# EAGLE design HbSizeSCircuit (EAGLE 8.6.3)

## Sheet 1 of 7: Power Supply
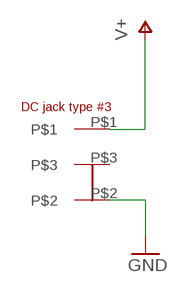
[diagram p0: schematic, sheet 1]

### Parts
U$7  HEC3110-01-010  [HEC3110-01-010]

### Nets
GND: U$7.P$2 ; also sheet 2,3,4,5,6,7
V+: U$7.P$1 ; also sheet 3
Unconnected: U$7.P$3

## Sheet 2 of 7: Power Switch
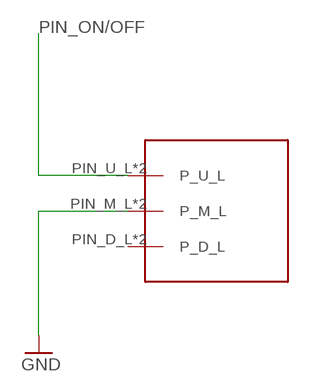
[diagram p1: schematic, sheet 2]

### Parts
U$2  IS-1250_POWERSWITCH  [IS-1250_POWERSWITCH]

### Nets
GND: U$2.PIN_M_L(P_M_L) U$2.PIN_M_R(P_M_L) ; also sheet 1,3,4,5,6,7
PIN_ON/OFF: U$2.PIN_U_L(P_U_L) U$2.PIN_U_R(P_U_L) ; also sheet 3
Unconnected: U$2.PIN_D_L(P_D_L) U$2.PIN_D_R(P_D_L)

## Sheet 3 of 7: DC-DC Converter
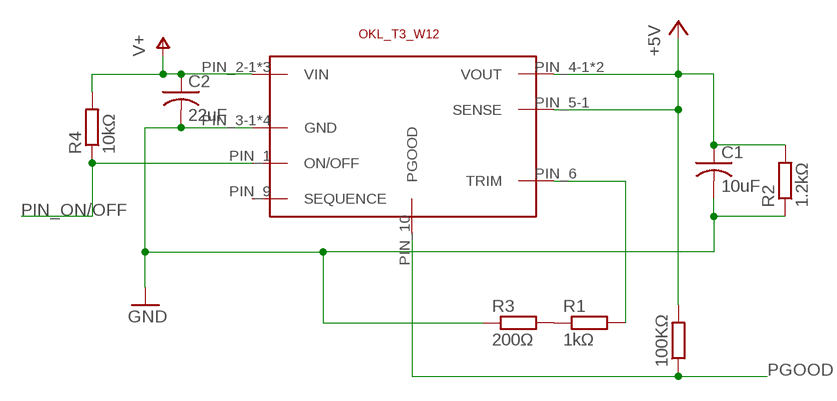
[diagram p2: schematic, sheet 3]

### Parts
100KΩ  R-EU_M1206  [M1206]
C1  10uF  C-USC1206  [C1206]
C2  22uF  C-USC1206  [C1206]
R1  1kΩ  R-EU_M1206  [M1206]
R2  1.2kΩ  R-EU_M1206  [M1206]
R3  200Ω  R-EU_M1206  [M1206]
R4  10kΩ  R-EU_R1206  [R1206]
U$8  OKL_T3_W12  [OKL_T3_W12]

### Nets
+5V: 100KΩ.2 C1.1 R2.2 U$8.PIN_4-1(VOUT) U$8.PIN_4-2(VOUT) U$8.PIN_5-1(SENSE) ; also sheet 5,6,7
GND: C1.2 C2.2 R2.1 R3.1 U$8.PIN_3-1(GND) U$8.PIN_3-2(GND) U$8.PIN_3-3(GND) U$8.PIN_7(GND) ; also sheet 1,2,4,5,6,7
N$1: R1.2 U$8.PIN_6(TRIM)
N$2: R1.1 R3.2
PGOOD: 100KΩ.1 U$8.PIN_10(PGOOD) ; also sheet 6
PIN_ON/OFF: R4.1 U$8.PIN_1(ON/OFF) ; also sheet 2
V+: C2.1 R4.2 U$8.PIN_2-1(VIN) U$8.PIN_2-2(VIN) U$8.PIN_2-3(VIN) ; also sheet 1
Unconnected: U$8.PIN_9(SEQUENCE)

## Sheet 4 of 7: Buttons
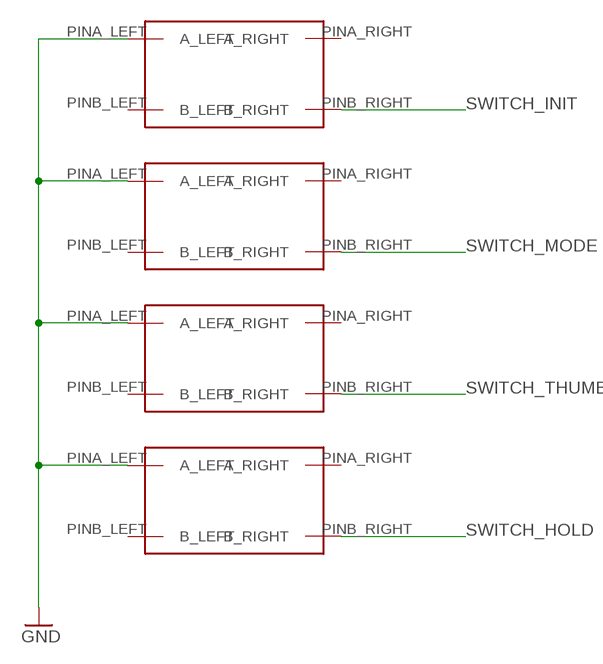
[diagram p3: schematic, sheet 4]

### Parts
U$1  SKRPACE010  [SKRPACE010]
U$3  SKRPACE010  [SKRPACE010]
U$4  SKRPACE010  [SKRPACE010]
U$5  SKRPACE010  [SKRPACE010]

### Nets
GND: U$1.PINA_LEFT(A_LEFT) U$3.PINA_LEFT(A_LEFT) U$4.PINA_LEFT(A_LEFT) U$5.PINA_LEFT(A_LEFT) ; also sheet 1,2,3,5,6,7
SWITCH_HOLD: U$5.PINB_RIGHT(B_RIGHT) ; also sheet 6
SWITCH_INIT: U$1.PINB_RIGHT(B_RIGHT) ; also sheet 6
SWITCH_MODE: U$3.PINB_RIGHT(B_RIGHT) ; also sheet 6
SWITCH_THUMB: U$4.PINB_RIGHT(B_RIGHT) ; also sheet 6
Unconnected: U$1.PINA_RIGHT(A_RIGHT) U$1.PINB_LEFT(B_LEFT) U$3.PINA_RIGHT(A_RIGHT) U$3.PINB_LEFT(B_LEFT) U$4.PINA_RIGHT(A_RIGHT) U$4.PINB_LEFT(B_LEFT) U$5.PINA_RIGHT(A_RIGHT) U$5.PINB_LEFT(B_LEFT)

## Sheet 5 of 7: ServoMotor
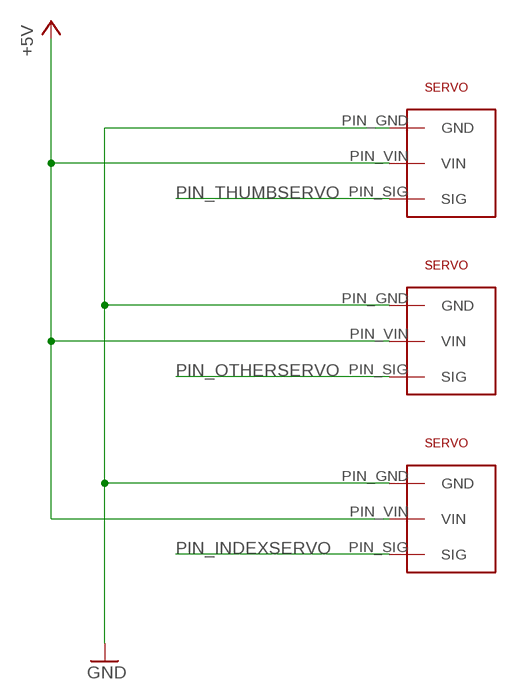
[diagram p4: schematic, sheet 5]

### Parts
U$9  53398-0371  [53398-0371]
U$11  53398-0371  [53398-0371]
U$12  53398-0371  [53398-0371]

### Nets
+5V: U$9.PIN_VIN(VIN) U$11.PIN_VIN(VIN) U$12.PIN_VIN(VIN) ; also sheet 3,6,7
GND: U$9.PIN_GND(GND) U$11.PIN_GND(GND) U$12.PIN_GND(GND) ; also sheet 1,2,3,4,6,7
PIN_INDEXSERVO: U$12.PIN_SIG(SIG) ; also sheet 6
PIN_OTHERSERVO: U$11.PIN_SIG(SIG) ; also sheet 6
PIN_THUMBSERVO: U$9.PIN_SIG(SIG) ; also sheet 6

## Sheet 6 of 7: CPU
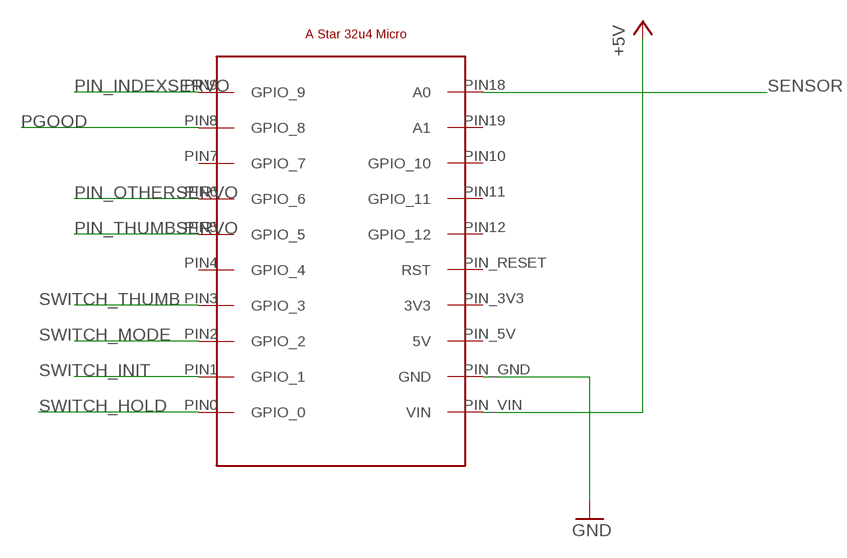
[diagram p5: schematic, sheet 6]

### Parts
U$6  POLOLU_A_STAR_32U4_MICRO_SMD  [POLOLU_A_STAR_32U4_MICRO_SMD]

### Nets
+5V: U$6.PIN_VIN(VIN) ; also sheet 3,5,7
GND: U$6.PIN_GND(GND) ; also sheet 1,2,3,4,5,7
PGOOD: U$6.PIN8(GPIO_8) ; also sheet 3
PIN_INDEXSERVO: U$6.PIN9(GPIO_9) ; also sheet 5
PIN_OTHERSERVO: U$6.PIN6(GPIO_6) ; also sheet 5
PIN_THUMBSERVO: U$6.PIN5(GPIO_5) ; also sheet 5
SENSOR: U$6.PIN18(A0) ; also sheet 7
SWITCH_HOLD: U$6.PIN0(GPIO_0) ; also sheet 4
SWITCH_INIT: U$6.PIN1(GPIO_1) ; also sheet 4
SWITCH_MODE: U$6.PIN2(GPIO_2) ; also sheet 4
SWITCH_THUMB: U$6.PIN3(GPIO_3) ; also sheet 4
Unconnected: U$6.PIN4(GPIO_4) U$6.PIN7(GPIO_7) U$6.PIN10(GPIO_10) U$6.PIN11(GPIO_11) U$6.PIN12(GPIO_12) U$6.PIN19(A1) U$6.PIN_3V3(3V3) U$6.PIN_5V(5V) U$6.PIN_RESET(RST)

## Sheet 7 of 7: Sensor
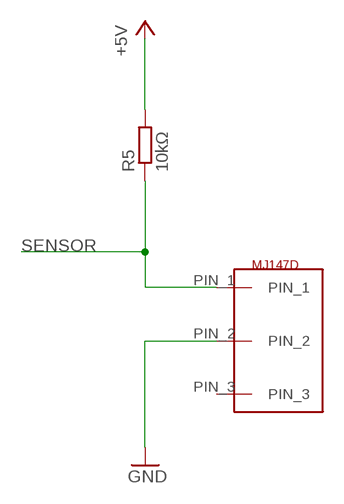
[diagram p6: schematic, sheet 7]

### Parts
R5  10kΩ  R-EU_R1206  [R1206]
U$10  MJ147D  [MJ147D]

### Nets
+5V: R5.2 ; also sheet 3,5,6
GND: U$10.PIN_2 ; also sheet 1,2,3,4,5,6
SENSOR: R5.1 U$10.PIN_1 ; also sheet 6
Unconnected: U$10.PIN_3

## Library data of the parts
100KΩ R1-R5 = resistor:R-EU_: RESISTOR, European symbol
C1 C2 = resistor:C-US: CAPACITOR, American symbol
U$1 U$3-U$5 = HbHandBoard_SizeM:SKRPACE010
U$2 = HbHandBoard_SizeS:IS-1250_POWERSWITCH
U$6 = HbHandBoard_SizeS:POLOLU_A_STAR_32U4_MICRO_SMD
U$7 = HbHandBoard_SizeS:HEC3110-01-010
U$8 = HbHandBoard_SizeS:OKL_T3_W12
U$9 U$11 U$12 = HbHandBoard_SizeS:53398-0371
U$10 = HbHandBoard_SizeS:MJ147D

## Board
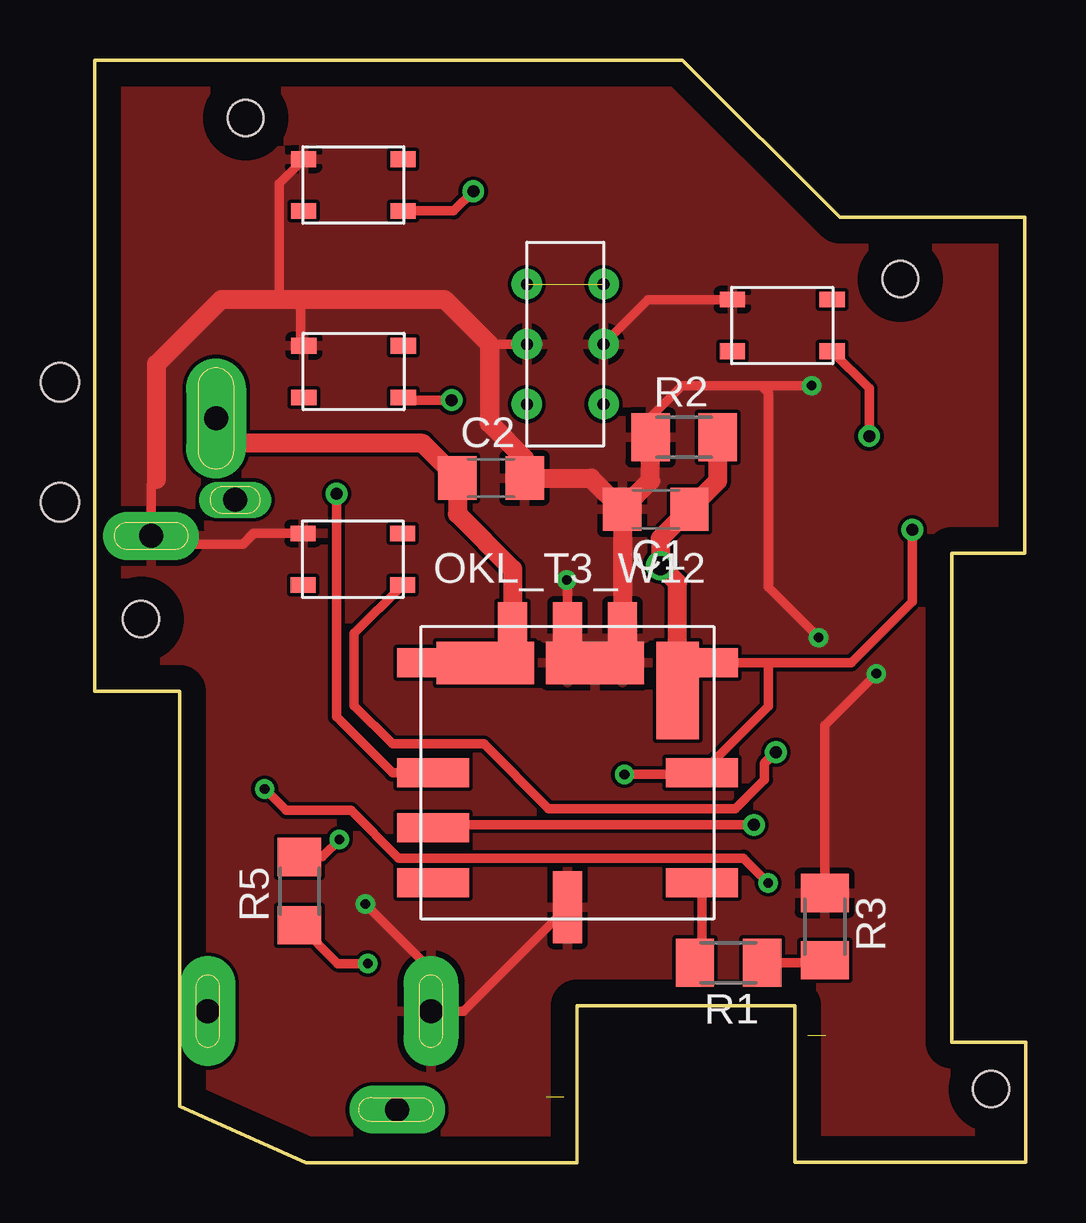
[diagram p7: board, top side]
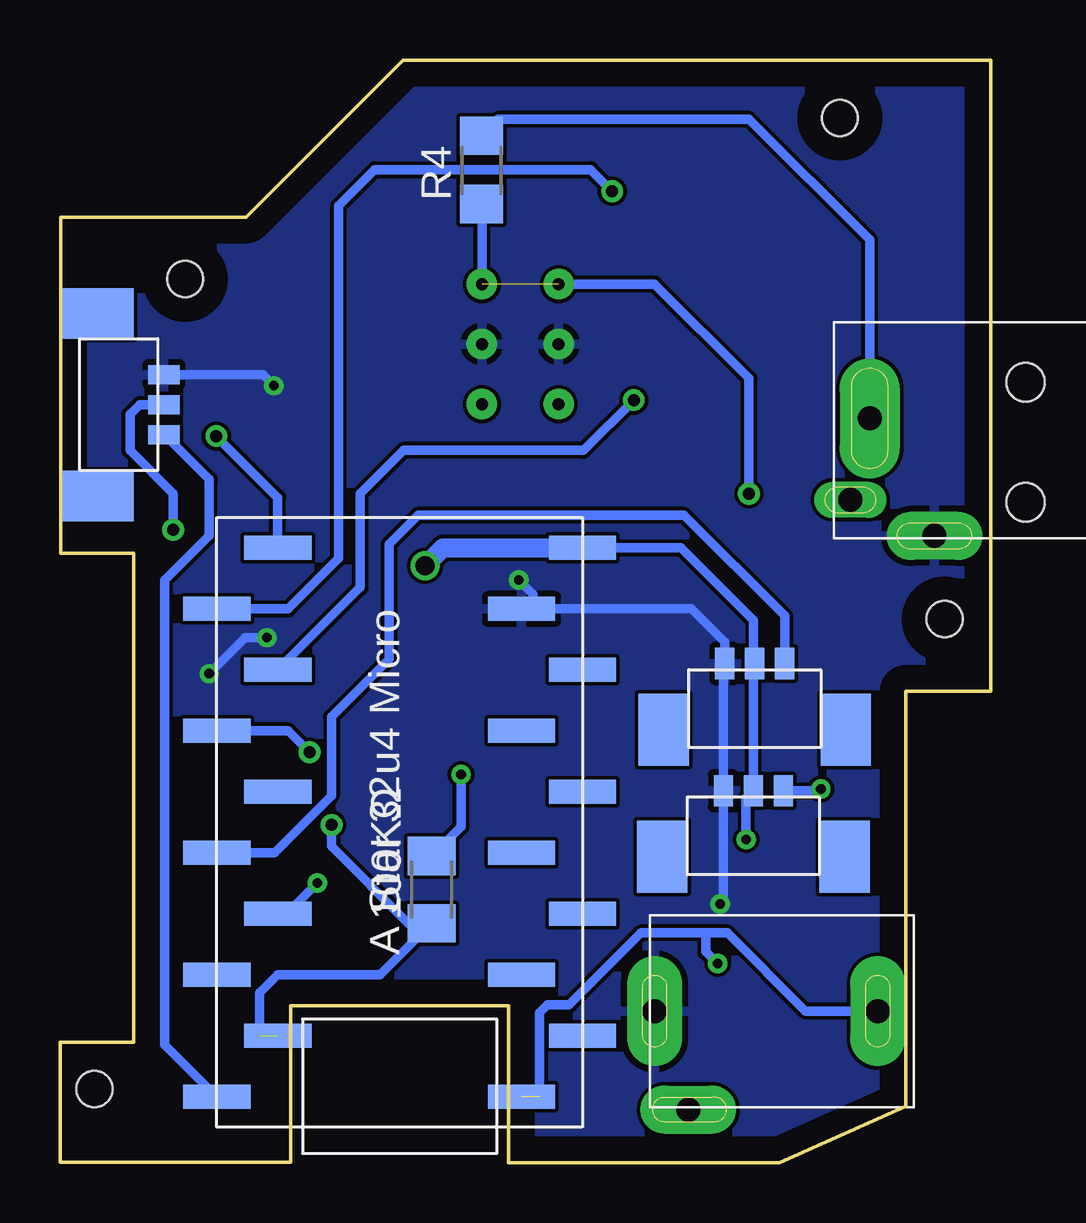
[diagram p8: board, bottom side, seen from below]

Size 38.81 x 45.94 mm. Coordinates in mm from the lower left corner, seen from the top.
Outline: 0,19.64 3.54,19.64 3.54,2.35 8.82,0 20.11,0 20.11,6.53 29.2,6.53 29.2,0.02 38.81,0.02 38.81,5.01 35.73,5.01 35.73,25.38 38.77,25.38 38.77,39.38 31.06,39.38 24.5,45.94 0,45.94 0,19.64
Copper layers (1*16): Top 0.035mm / dielectric 1.5mm / Bottom 0.035mm
Design rules "default": minimum track width 6mil, minimum drill 0.35mm, track to track 6mil, track to pad 6mil, pad to pad 6mil, via to via 6mil, smd to smd 6mil, copper to edge 40mil, drill to drill 6mil, minimum pad ring 10mil, minimum via ring 8mil, stop-mask expansion 4mil, vias tented up to drill 0mil, thermal gap 10mil
Holes 1.5 mm at 1.94,22.64 37.38,3.06 33.59,36.81 6.3,43.52

### Footprints (pad centres in the part's own frame; a part is rotated, then mirrored left to right if it is on the bottom)
M1206 = smd 1.6 x 2: 1 -1.4,0; 2 1.4,0
C1206 = smd 1.6 x 1.8: 1 -1.4,0; 2 1.4,0
R1206 = smd 1.6 x 1.803: 1 -1.422,0; 2 1.422,0
SKRPACE010 = smd 1.05 x 0.65: PINA_LEFT -2.075,1.075; PINA_RIGHT 2.075,1.075; PINB_LEFT -2.075,-1.075; PINB_RIGHT 2.075,-1.075
IS-1250_POWERSWITCH = drill 0.5 pad 1.27: PIN_D_L -1.6,-2.5; PIN_D_R 1.6,-2.5; PIN_M_L -1.6,0; PIN_M_R 1.6,0; PIN_U_L -1.6,2.5; PIN_U_R 1.6,2.5
POLOLU_A_STAR_32U4_MICRO_SMD = smd 2.801 x 1: PIN0 5.08,-11.43; PIN1 7.62,-8.89; PIN2 5.08,-6.35; PIN3 7.62,-3.81; PIN4 5.08,-1.27; PIN5 7.62,1.27; PIN6 5.08,3.81; PIN7 7.62,6.35; PIN8 5.08,8.89; PIN9 7.62,11.43; PIN10 -5.08,6.35; PIN11 -7.62,3.81; PIN12 -5.08,1.27; PIN18 -5.08,11.43; PIN19 -7.62,8.89; PIN_3V3 -5.08,-3.81; PIN_5V -7.62,-6.35; PIN_GND -5.08,-8.89; PIN_RESET -7.62,-1.27; PIN_VIN -7.62,-11.43
HEC3110-01-010 = drill 1 pad 2.5 long: P$1 6.5,0 | drill 1 pad 2 long: P$2 3.8,4.9 | drill 1 pad 1.5 long: P$3 7.3,3.4 | hole 1.6: 0,3.5; 0,-1.5
OKL_T3_W12 = smd 3 x 1.2: PIN_1 0.5,6.1; PIN_2-1 0.5,10.68; PIN_4-1 11.7,10.68; PIN_5-1 11.7,6.1; PIN_6 11.7,1.52; PIN_9 0.5,1.52; PIN_10 0.5,3.81 | smd 4.07 x 1.77: PIN_2-2 2.665,10.68; PIN_3-2 7.245,10.68 | smd 1.2 x 3: PIN_2-3 3.81,11.7; PIN_3-1 6.1,11.7; PIN_3-3 8.39,11.7; PIN_7 6.1,0.5 | smd 1.77 x 4.07: PIN_4-2 10.685,9.535
53398-0371 = smd 2.1 x 3: P$4 3.8,-2.75; P$5 -3.8,-2.75 | smd 0.8 x 1.3: PIN_GND -1.25,0; PIN_SIG 1.25,0; PIN_VIN 0,0
MJ147D = drill 1 pad 2.3 long: PIN_1 0,0; PIN_2 0,-9.3 | drill 1 pad 2 long: PIN_3 4.1,-7.9

### Placement (x,y rotation side)
100KΩ  23.32,11.37 90 bottom
C1  23.4,27.22 180 top
C2  16.53,28.52 0 top
R1  26.43,8.32 180 top
R2  24.58,30.22 0 top
R3  30.44,9.83 270 top
R4  21.24,41.36 90 bottom
R5  8.54,11.31 90 top
U$1  10.79,40.73 0 top
U$2  19.62,34.1 0 top
U$3  10.8,32.96 0 top
U$4  10.77,25.14 0 top
U$5  28.67,34.88 0 top
U$6  24.65,14.18 180 bottom
U$7  -1.44,31.01 180 bottom
U$8  13.62,10.14 0 top
U$9  9.85,20.79 0 bottom
U$10  4.72,6.31 270 bottom
U$11  9.91,15.49 0 bottom
U$12  34.48,31.58 270 bottom

### Tracks (layer width: path | path; a pad name or v marks a point on that pad's centre or on a via)
+5V  (via drill 0.4, 0.5, 0.8)
  Top 0.4: 28.09,20.82 U$8.PIN_4-1 25.32,20.69 U$8.PIN_4-2 | 28.09,20.82 31.54,20.82 34.09,23.37 v34.09,26.37 | 28.09,20.82 28.09,19.01 U$8.PIN_5-1 25.25,16.17 v22.09,16.17 | v10.21,13.46 9.48,12.73 R5.2
  Top 0.8: U$8.PIN_4-2 24.3,24.16 v23.59,24.87 23.59,26.01 C1.1 25.98,28.4 R2.2
  Bottom 0.4: 9.91,20.73 U$11.PIN_VIN 10.21,15.19 v10.21,13.46 | 9.91,20.73 U$9.PIN_VIN | U$6.PIN_VIN 12.93,25.61 9.91,22.59 9.91,20.73 | v34.09,26.37 34.09,27.87 35.89,29.67 35.89,31.17 35.48,31.58 U$12.PIN_VIN | 100KΩ.2 22.09,14 v22.09,16.17
  Bottom 0.8: v23.59,24.87 22.85,25.61 U$6.PIN_VIN
GND  (via drill 0.4)
  Top 0.4: U$8.PIN_7 15.39,6.31 U$10.PIN_2 14.02,8.04 v11.29,10.77 | U$3.PINA_LEFT 8.59,34.17 8.59,35.97 | U$1.PINA_LEFT 7.69,40.78 7.69,35.97 | 16.39,34.17 16.46,34.1 U$2.PIN_M_L | U$2.PIN_M_R 23.07,35.95 U$5.PINA_LEFT | v19.69,24.27 19.72,24.24 U$8.PIN_3-1 19.84,21.84 U$8.PIN_3-2 21.89,21.84 U$8.PIN_3-3 | R3.1 30.44,18.22 v32.59,20.37 | v30.19,21.87 28.09,23.97 28.09,32.07 27.79,32.37 | 27.79,32.37 24.49,32.37 23.18,31.06 R2.1 | v29.89,32.37 27.79,32.37 | U$4.PINA_LEFT 6.63,26.21 6.19,25.77 2.7,25.77 U$7.P$2 2.36,28.24 2.59,28.47
  Top 0.8: 2.59,28.47 2.59,33.27 5.29,35.97 7.69,35.97 8.59,35.97 14.59,35.97 16.39,34.17 | 16.46,34.1 16.46,30.8 17.93,29.33 C2.2 20.7,28.52 C1.2 | C1.2 U$8.PIN_3-3 | C1.2 23.18,28.4 R2.1
  Bottom 0.4: 19.09,23.07 12.49,23.07 11.1,21.68 U$9.PIN_GND 11.16,20.73 U$11.PIN_GND 11.16,10.9 v11.29,10.77 | 19.09,23.07 U$6.PIN_GND | v19.69,24.27 19.09,23.67 19.09,23.07 | v32.59,20.37 31.09,21.87 v30.19,21.87 | U$12.PIN_GND 30.35,32.83 v29.89,32.37
  pour Top: -2.81,50.37 44.59,50.37 44.59,-3.93 -2.81,-3.93
  pour Bottom: -4.01,52.17 46.69,52.17 46.69,-6.33 -4.01,-6.33
N$1
  Top 0.4: U$8.PIN_6 25.32,8.61 R1.2
N$2
  Top 0.4: R1.1 30.33,8.32 R3.2
PGOOD  (via drill 0.5)  (1 unrouted)
  Top 0.4: v27.49,14.07 14.24,14.07 U$8.PIN_10
  Bottom 0.4: 30.49,5.29 30.49,7.07 29.73,7.82 25.47,7.82 100KΩ.1 24.29,9.97 27.49,13.17 v27.49,14.07
PIN_INDEXSERVO
  Bottom 0.4: U$6.PIN9 34.44,4.92 34.44,24.27 32.59,26.12 32.59,28.47 34.45,30.33 U$12.PIN_SIG
PIN_ON/OFF  (via drill 0.5)  (1 unrouted)
  Top 0.4: U$8.PIN_1 12.42,16.24 10.09,18.57 v10.09,27.87
  Bottom 0.4: U$2.PIN_U_R 21.22,39.92 R4.1 | v10.09,27.87 10.09,32.67 14.02,36.6 U$2.PIN_U_L
PIN_OTHERSERVO  (via drill 0.4)
  Top 0.4: v7.09,15.57 7.99,14.67 10.69,14.67 12.68,12.68 27.05,12.68 v28.08,11.65
  Bottom 0.4: U$11.PIN_SIG 7.17,15.49 v7.09,15.57 | v28.08,11.65 29.36,10.37 U$6.PIN6
PIN_THUMBSERVO
  Bottom 0.4: U$9.PIN_SIG 8.6,22.78 12.79,26.97 23.89,26.97 25.09,25.77 25.09,20.97 27.49,18.57 27.49,15.29 29.87,12.91 U$6.PIN5
SENSOR  (via drill 0.4)  (1 unrouted)
  Top 0.4: R5.1 10.14,8.29 v11.4,8.29
  Bottom 0.4: U$10.PIN_1 7.73,6.31 10.99,9.57 11.89,9.57 | 11.89,9.57 14.59,9.57 17.59,6.57 18.49,6.57 18.82,6.24 18.82,2.75 | v11.4,8.29 11.89,8.78 11.89,9.57
SWITCH_HOLD  (via drill 0.5)
  Top 0.4: v32.29,30.27 32.29,32.26 U$5.PINB_RIGHT
  Bottom 0.4: U$6.PIN0 29.73,27.71 v32.29,30.27
SWITCH_INIT  (via drill 0.5)
  Top 0.4: v15.79,40.47 14.98,39.66 U$1.PINB_RIGHT
  Bottom 0.4: U$6.PIN1 29.29,23.07 27.19,25.17 27.19,39.87 25.69,41.37 16.69,41.37 v15.79,40.47
SWITCH_MODE  (via drill 0.5)
  Top 0.4: U$3.PINB_RIGHT 12.99,31.77 v14.89,31.77
  Bottom 0.4: v14.89,31.77 16.99,29.67 24.49,29.67 26.29,27.87 26.29,23.97 U$6.PIN2
SWITCH_THUMB  (via drill 0.5)
  Top 0.4: U$4.PINB_RIGHT 10.83,22.05 10.83,19.04 12.43,17.44 16.23,17.44 18.93,14.74 26.71,14.74 27.93,15.96 27.93,16.63 v28.4,17.1
  Bottom 0.4: v28.4,17.1 29.29,17.99 U$6.PIN3
V+
  Top 0.4: U$8.PIN_2-1 U$8.PIN_2-2 17.3,21.84 U$8.PIN_2-3
  Top 0.8: U$8.PIN_2-3 17.43,24.73 15.13,27.03 C2.1 13.68,29.97 6.1,29.97 U$7.P$1
  Bottom 0.4: U$7.P$1 5.06,38.44 10.09,43.47 20.55,43.47 R4.2